# EasyEDA schematic SmartCart-B1-Modules.json
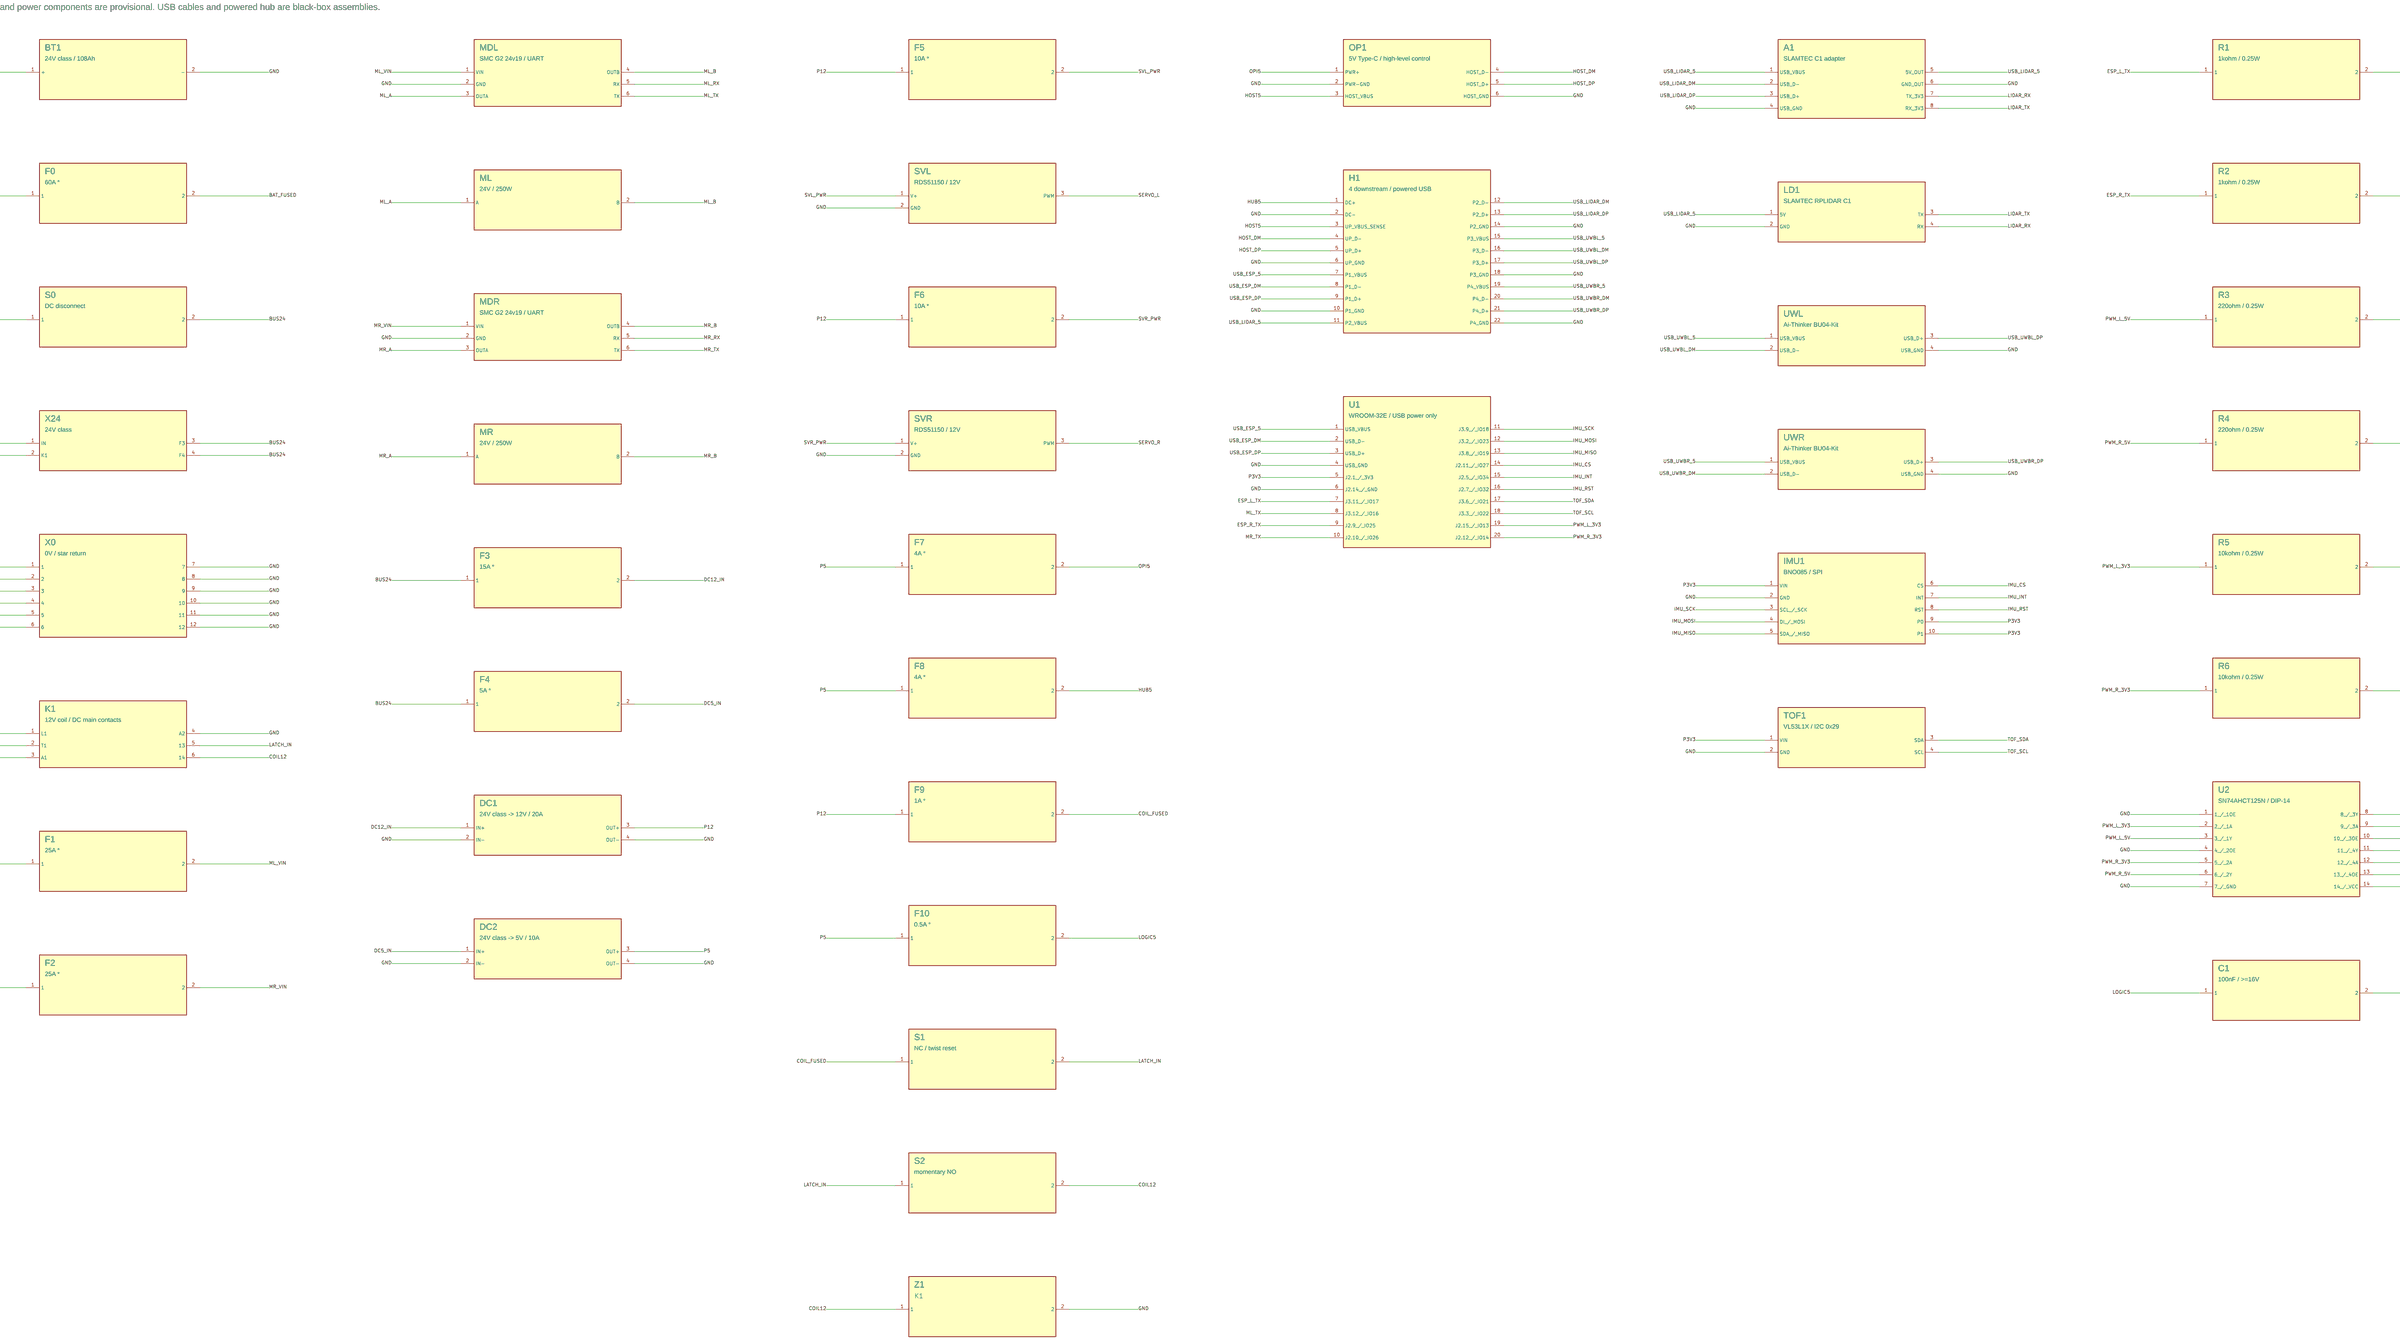
[diagram p0: schematic sheet]

## Parts
A1  SLAMTEC C1 adapter
BT1  24V class / 108Ah
C1  100nF / >=16V
DC1  24V class -> 12V / 20A
DC2  24V class -> 5V / 10A
F0  60A *
F1  25A *
F2  25A *
F3  15A *
F4  5A *
F5  10A *
F6  10A *
F7  4A *
F8  4A *
F9  1A *
F10  0.5A *
H1  4 downstream / powered USB
IMU1  BNO085 / SPI
K1  12V coil / DC main contacts
LD1  SLAMTEC RPLIDAR C1
MDL  SMC G2 24v19 / UART
MDR  SMC G2 24v19 / UART
ML  24V / 250W
MR  24V / 250W
OP1  5V Type-C / high-level control
R1  1kohm / 0.25W
R2  1kohm / 0.25W
R3  220ohm / 0.25W
R4  220ohm / 0.25W
R5  10kohm / 0.25W
R6  10kohm / 0.25W
S0  DC disconnect
S1  NC / twist reset
S2  momentary NO
SVL  RDS51150 / 12V
SVR  RDS51150 / 12V
TOF1  VL53L1X / I2C 0x29
U1  WROOM-32E / USB power only
U2  SN74AHCT125N / DIP-14
UWL  Ai-Thinker BU04-Kit
UWR  Ai-Thinker BU04-Kit
X0  0V / star return
X24  24V class
Z1  K1 지정품

## Library data of the parts
A1 = A1: Contributor: SmartCart
BT1 = BT1: Contributor: SmartCart
C1 = C1: Contributor: SmartCart
DC1 = DC1: Contributor: SmartCart
DC2 = DC2: Contributor: SmartCart
F0 = F0: Contributor: SmartCart
F1 = F1: Contributor: SmartCart
F2 = F2: Contributor: SmartCart
F3 = F3: Contributor: SmartCart
F4 = F4: Contributor: SmartCart
F5 = F5: Contributor: SmartCart
F6 = F6: Contributor: SmartCart
F7 = F7: Contributor: SmartCart
F8 = F8: Contributor: SmartCart
F9 = F9: Contributor: SmartCart
F10 = F10: Contributor: SmartCart
H1 = H1: Contributor: SmartCart
IMU1 = IMU1: Contributor: SmartCart
K1 = K1: Contributor: SmartCart
LD1 = LD1: Contributor: SmartCart
MDL = MDL: Contributor: SmartCart
MDR = MDR: Contributor: SmartCart
ML = ML: Contributor: SmartCart
MR = MR: Contributor: SmartCart
OP1 = OP1: Contributor: SmartCart
R1 = R1: Contributor: SmartCart
R2 = R2: Contributor: SmartCart
R3 = R3: Contributor: SmartCart
R4 = R4: Contributor: SmartCart
R5 = R5: Contributor: SmartCart
R6 = R6: Contributor: SmartCart
S0 = S0: Contributor: SmartCart
S1 = S1: Contributor: SmartCart
S2 = S2: Contributor: SmartCart
SVL = SVL: Contributor: SmartCart
SVR = SVR: Contributor: SmartCart
TOF1 = TOF1: Contributor: SmartCart
U1 = U1: Contributor: SmartCart
U2 = U2: Contributor: SmartCart
UWL = UWL: Contributor: SmartCart
UWR = UWR: Contributor: SmartCart
X0 = X0: Contributor: SmartCart
X24 = X24: Contributor: SmartCart
Z1 = Z1: Contributor: SmartCart

## Nets
GND: A1.4(USB_GND) A1.6(GND_OUT) BT1.2(-) C1.2 DC1.2(IN-) DC1.4(OUT-) DC2.2(IN-) DC2.4(OUT-) H1.2(DC-) H1.6(UP_GND) H1.10(P1_GND) H1.14(P2_GND) H1.18(P3_GND) H1.22(P4_GND) IMU1.2(GND) K1.4(A2) LD1.2(GND) MDL.2(GND) MDR.2(GND) OP1.2(PWR-GND) OP1.6(HOST_GND) R5.2 R6.2 SVL.2(GND) SVR.2(GND) TOF1.2(GND) U1.4(USB_GND) U1.6(J2.14 / GND) U2.1(1 / 1OE) U2.4(4 / 2OE) U2.7(7 / GND) U2.9(9 / 3A) U2.12(12 / 4A) UWL.4(USB_GND) UWR.4(USB_GND) X0.1 X0.2 X0.3 X0.4 X0.5 X0.6 X0.7 X0.8 X0.9 X0.10 X0.11 X0.12 Z1.2
P3V3: IMU1.1(VIN) IMU1.9(P0) IMU1.10(P1) TOF1.1(VIN) U1.5(J2.1 / 3V3)
BAT_FUSED: F0.2 S0.1
BAT_POS: BT1.1(+) F0.1
BUS24: F3.1 F4.1 K1.1(L1) S0.2 X24.1(IN) X24.2(K1) X24.3(F3) X24.4(F4)
COIL12: K1.3(A1) K1.6(14) S2.2 Z1.1
COIL_FUSED: F9.2 S1.1
DC5_IN: DC2.1(IN+) F4.2
DC12_IN: DC1.1(IN+) F3.2
DRIVE24: F1.1 F2.1 K1.2(T1)
ESP_L_TX: R1.1 U1.7(J3.11 / IO17)
ESP_R_TX: R2.1 U1.9(J2.9 / IO25)
HOST5: H1.3(UP_VBUS_SENSE) OP1.3(HOST_VBUS)
HOST_DM: H1.4(UP_D-) OP1.4(HOST_D-)
HOST_DP: H1.5(UP_D+) OP1.5(HOST_D+)
HUB5: F8.2 H1.1(DC+)
IMU_CS: IMU1.6(CS) U1.14(J2.11 / IO27)
IMU_INT: IMU1.7(INT) U1.15(J2.5 / IO34)
IMU_MISO: IMU1.5(SDA / MISO) U1.13(J3.8 / IO19)
IMU_MOSI: IMU1.4(DI / MOSI) U1.12(J3.2 / IO23)
IMU_RST: IMU1.8(RST) U1.16(J2.7 / IO32)
IMU_SCK: IMU1.3(SCL / SCK) U1.11(J3.9 / IO18)
LATCH_IN: K1.5(13) S1.2 S2.1
LIDAR_RX: A1.7(TX_3V3) LD1.4(RX)
LIDAR_TX: A1.8(RX_3V3) LD1.3(TX)
LOGIC5: C1.1 F10.2 U2.10(10 / 3OE) U2.13(13 / 4OE) U2.14(14 / VCC)
ML_A: MDL.3(OUTA) ML.1(A)
ML_B: MDL.4(OUTB) ML.2(B)
ML_RX: MDL.5(RX) R1.2
ML_TX: MDL.6(TX) U1.8(J3.12 / IO16)
ML_VIN: F1.2 MDL.1(VIN)
MR_A: MDR.3(OUTA) MR.1(A)
MR_B: MDR.4(OUTB) MR.2(B)
MR_RX: MDR.5(RX) R2.2
MR_TX: MDR.6(TX) U1.10(J2.10 / IO26)
MR_VIN: F2.2 MDR.1(VIN)
NC_U2_8: U2.8(8 / 3Y)
NC_U2_11: U2.11(11 / 4Y)
OPI5: F7.2 OP1.1(PWR+)
P5: DC2.3(OUT+) F7.1 F8.1 F10.1
P12: DC1.3(OUT+) F5.1 F6.1 F9.1
PWM_L_3V3: R5.1 U1.19(J2.15 / IO13) U2.2(2 / 1A)
PWM_L_5V: R3.1 U2.3(3 / 1Y)
PWM_R_3V3: R6.1 U1.20(J2.12 / IO14) U2.5(5 / 2A)
PWM_R_5V: R4.1 U2.6(6 / 2Y)
SERVO_L: R3.2 SVL.3(PWM)
SERVO_R: R4.2 SVR.3(PWM)
SVL_PWR: F5.2 SVL.1(V+)
SVR_PWR: F6.2 SVR.1(V+)
TOF_SCL: TOF1.4(SCL) U1.18(J3.3 / IO22)
TOF_SDA: TOF1.3(SDA) U1.17(J3.6 / IO21)
USB_ESP_5: H1.7(P1_VBUS) U1.1(USB_VBUS)
USB_ESP_DM: H1.8(P1_D-) U1.2(USB_D-)
USB_ESP_DP: H1.9(P1_D+) U1.3(USB_D+)
USB_LIDAR_5: A1.1(USB_VBUS) A1.5(5V_OUT) H1.11(P2_VBUS) LD1.1(5V)
USB_LIDAR_DM: A1.2(USB_D-) H1.12(P2_D-)
USB_LIDAR_DP: A1.3(USB_D+) H1.13(P2_D+)
USB_UWBL_5: H1.15(P3_VBUS) UWL.1(USB_VBUS)
USB_UWBL_DM: H1.16(P3_D-) UWL.2(USB_D-)
USB_UWBL_DP: H1.17(P3_D+) UWL.3(USB_D+)
USB_UWBR_5: H1.19(P4_VBUS) UWR.1(USB_VBUS)
USB_UWBR_DM: H1.20(P4_D-) UWR.2(USB_D-)
USB_UWBR_DP: H1.21(P4_D+) UWR.3(USB_D+)

## Notes on the sheet
- SMART CART B1 / MODULE + BREADBOARD ELECTRICAL SCHEMATIC
- No PCB. Same-name net labels are connected. Confirm all physical pin names against purchased modules.
- * Fuse ratings and power components are provisional. USB cables and powered hub are black-box assemblies.
